# EAGLE design persimmon_circle (EAGLE 9.6.2)
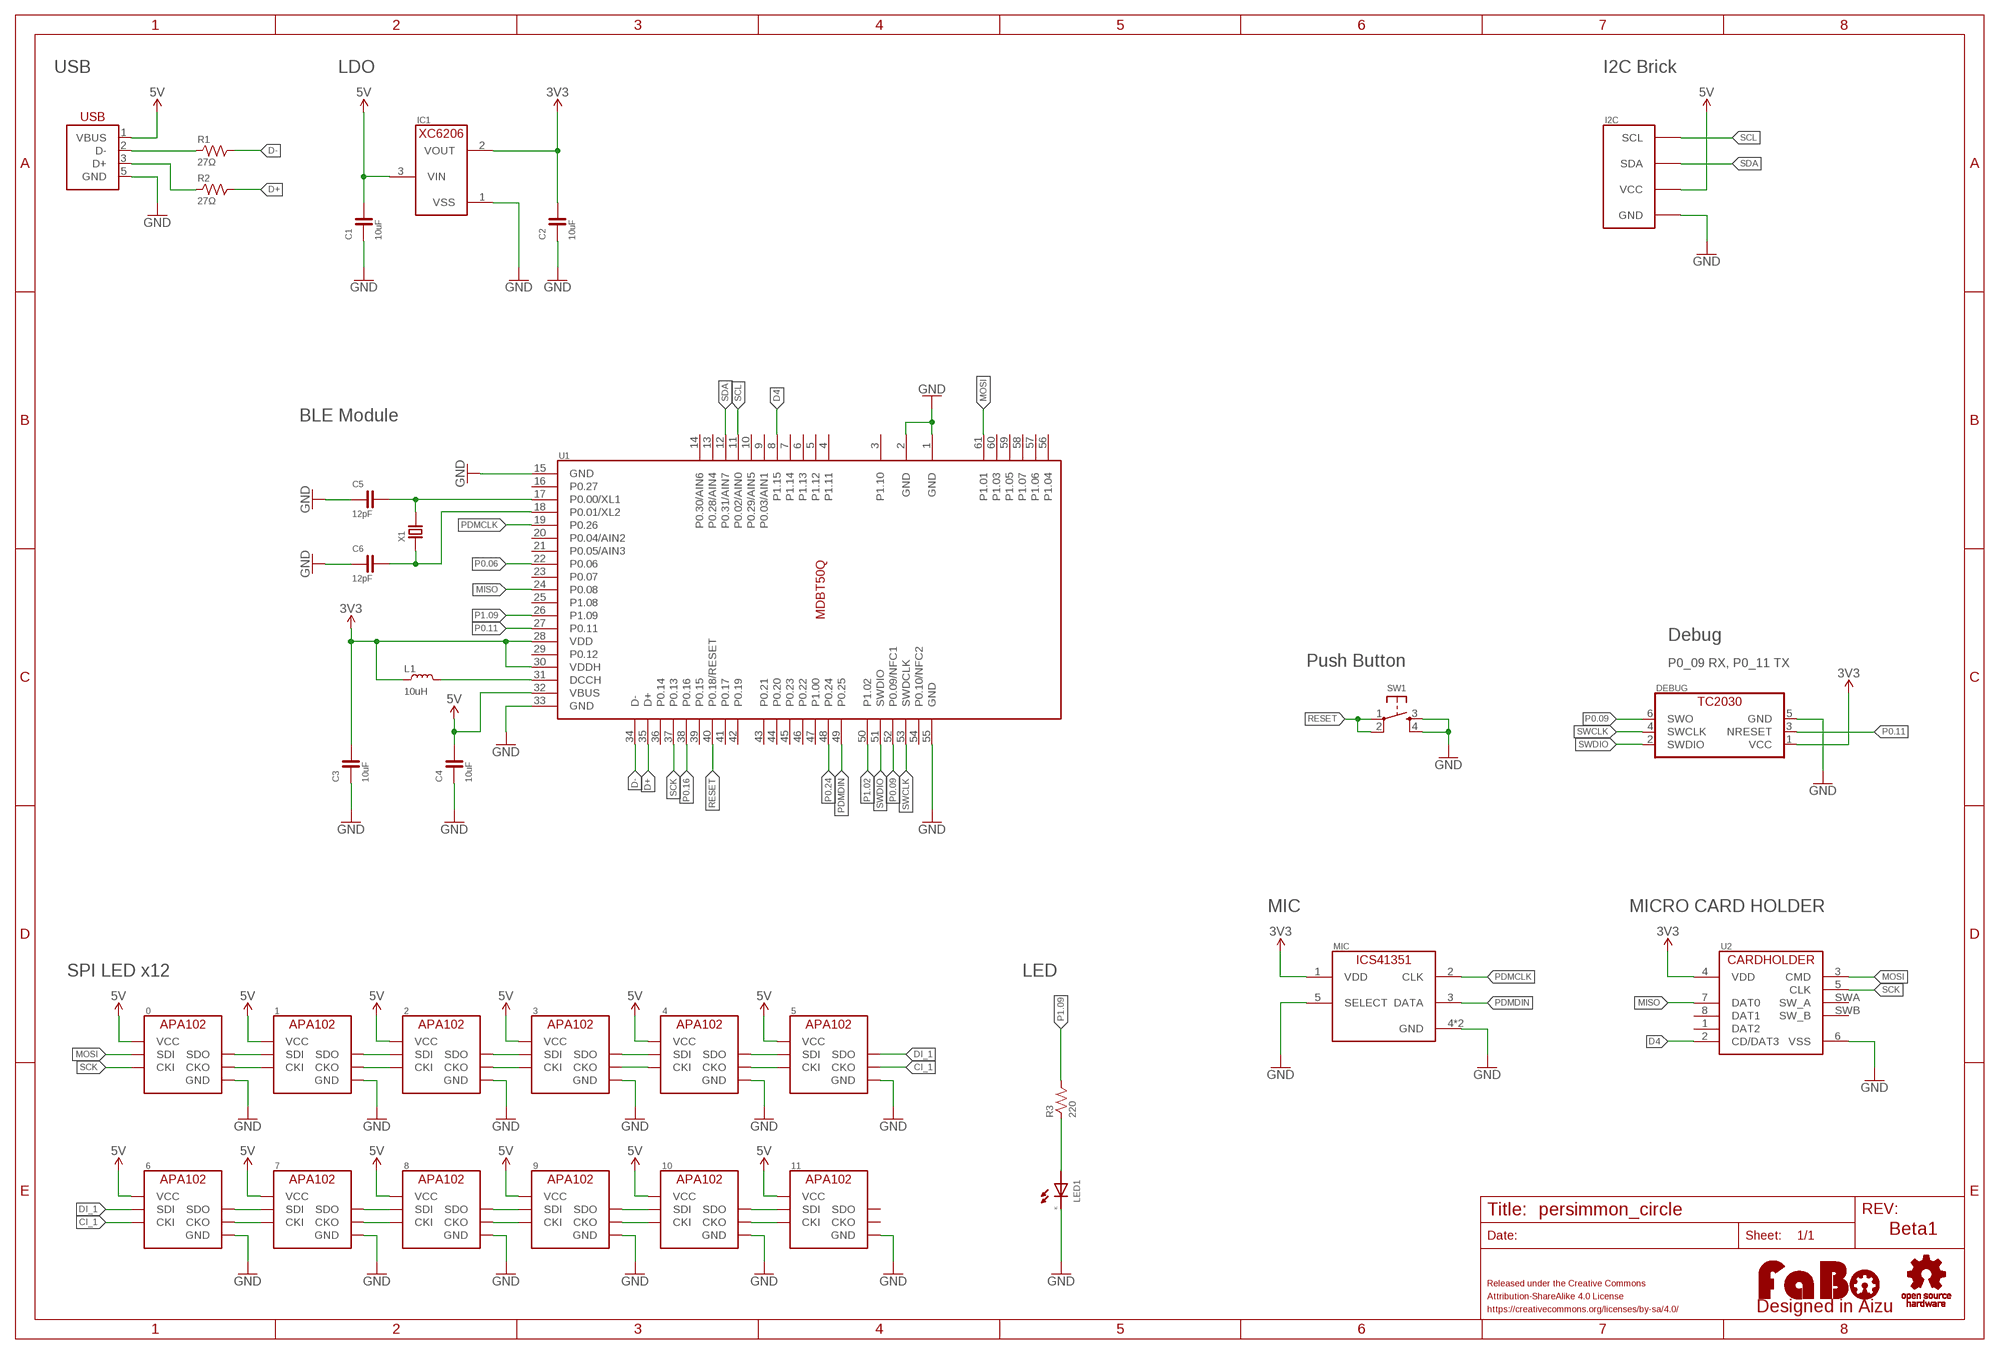
[diagram p0: schematic, sheet 1]

## Parts
0  APA102_IPIXEL  [APA102_2020]
1  APA102_IPIXEL  [APA102_2020]
2  APA102_IPIXEL  [APA102_2020]
3  APA102_IPIXEL  [APA102_2020]
4  APA102_IPIXEL  [APA102_2020]
5  APA102_IPIXEL  [APA102_2020]
6  APA102_IPIXEL  [APA102_2020]
7  APA102_IPIXEL  [APA102_2020]
8  APA102_IPIXEL  [APA102_2020]
9  APA102_IPIXEL  [APA102_2020]
10  APA102_IPIXEL  [APA102_2020]
11  APA102_IPIXEL  [APA102_2020]
C1  10uF  CAPACITOR-0603  [0603]
C2  10uF  CAPACITOR-0603  [0603]
C3  10uF  CAPACITOR-0603  [0603]
C4  10uF  CAPACITOR-0603  [0603]
C5  12pF  CAPACITOR-0603  [0603]
C6  12pF  CAPACITOR-0603  [0603]
DEBUG  TC2030-IDC-NL  [TC2030-IDC-NL]
I2C  FABO_BRICK_I2C-B04B-PASK-1  [FABO_BRICK_I2C_B04B-PASK-1]
IC1  XC6206  [SOT-23]
L1  10uH  COIL-0603  [0603]
LED1  LED-0603  [0603]
LOGO1  LOGO_OSHW-M_BOTTOM  [LOGO_OSHW_M_BOTTOM]
LOGO2  LOGO_FABO-M  [LOGO_FABO_M]
MIC  TDK-ICS41351  [ICS41351]
R1  27Ω  RESISTOR-0603  [0603]
R2  27Ω  RESISTOR-0603  [0603]
R3  220  RESISTOR-0603  [0603]
SW1  TACT-SWITCH-SMD_KMR2  [KMR2]
U1  MDBT50  [MDBT50]
U2  CARDHOLDER_MICRO  [DM3AT-SF-PEJM5]
USB  USB-ZX62D-B-5PA8  [ZX62D-B-5PA8]
X1  CRYSTAL-ABS07  [ABRACON-ABS07-32.768KHZ]

## Nets
3V3: C2.2 C3.2 DEBUG.1(VCC) IC1.2(VOUT) L1.1 MIC.1(VDD) U1.28(VDD) U1.30(VDDH) U2.4(VDD)
5V: 0.VCC 1.VCC 2.VCC 3.VCC 4.VCC 5.VCC 6.VCC 7.VCC 8.VCC 9.VCC 10.VCC 11.VCC C1.2 C4.2 I2C.VCC IC1.3(VIN) U1.32(VBUS) USB.1(VBUS)
CI0: 0.CKO 1.CKI
CI1: 1.CKO 2.CKI
CI2: 2.CKO 3.CKI
CI3: 3.CKO 4.CKI
CI4: 4.CKO 5.CKI
CI6: 6.CKO 7.CKI
CI7: 7.CKO 8.CKI
CI8: 8.CKO 9.CKI
CI9: 9.CKO 10.CKI
CI10: 10.CKO 11.CKI
CI_1: 5.CKO 6.CKI
D4: U1.8(P1.15) U2.2(CD/DAT3)
D+: R2.2 U1.35(D+)
D-: R1.2 U1.34(D-)
DI0: 0.SDO 1.SDI
DI1: 1.SDO 2.SDI
DI2: 2.SDO 3.SDI
DI3: 3.SDO 4.SDI
DI4: 4.SDO 5.SDI
DI6: 6.SDO 7.SDI
DI7: 7.SDO 8.SDI
DI8: 8.SDO 9.SDI
DI9: 9.SDO 10.SDI
DI10: 10.SDO 11.SDI
DI_1: 5.SDO 6.SDI
GND: 0.GND 1.GND 2.GND 3.GND 4.GND 5.GND 6.GND 7.GND 8.GND 9.GND 10.GND 11.GND C1.1 C2.1 C3.1 C4.1 C5.1 C6.1 DEBUG.5(GND) I2C.GND IC1.1(VSS) LED1.CATHODE MIC.4(GND) MIC.5(SELECT) MIC.6(GND) SW1.3 SW1.4 U1.1(GND) U1.2(GND) U1.15(GND) U1.33(GND) U1.55(GND) U2.6(VSS) USB.5(GND)
L1: L1.2 U1.31(DCCH)
LED1: LED1.ANODE R3.1
MISO: U1.24(P0.08) U2.7(DAT0)
MOSI: 0.SDI U1.61(P1.01) U2.3(CMD)
P0.06: U1.22(P0.06)
P0.09: DEBUG.6(SWO) U1.52(P0.09/NFC1)
P0.11: DEBUG.3(NRESET) U1.27(P0.11)
P0.16: U1.38(P0.16)
P0.24: U1.48(P0.24)
P1.02: U1.50(P1.02)
P1.09: R3.2 U1.26(P1.09)
PDMCLK: MIC.2(CLK) U1.19(P0.26)
PDMDIN: MIC.3(DATA) U1.49(P0.25)
RESET: SW1.1 SW1.2 U1.40(P0.18/RESET)
SCK: 0.CKI U1.37(P0.13) U2.5(CLK)
SCL: I2C.SCL U1.11(P0.02/AIN0)
SDA: I2C.SDA U1.12(P0.31/AIN7)
SWCLK: DEBUG.4(SWCLK) U1.53(SWDCLK)
SWDIO: DEBUG.2(SWDIO) U1.51(SWDIO)
USB_DM: R1.1 USB.2(D-)
USB_DP: R2.1 USB.3(D+)
X1: C5.2 U1.17(P0.00/XL1) X1.P$2
X2: C6.2 U1.18(P0.01/XL2) X1.P$1
Unconnected: 11.CKO 11.SDO U1.3(P1.10) U1.4(P1.11) U1.5(P1.12) U1.6(P1.13) U1.7(P1.14) U1.9(P0.03/AIN1) U1.10(P0.29/AIN5) U1.13(P0.28/AIN4) U1.14(P0.30/AIN6) U1.16(P0.27) U1.20(P0.04/AIN2) U1.21(P0.05/AIN3) U1.23(P0.07) U1.25(P1.08) U1.29(P0.12) U1.36(P0.14) U1.39(P0.15) U1.41(P0.17) U1.42(P0.19) U1.43(P0.21) U1.44(P0.20) U1.45(P0.23) U1.46(P0.22) U1.47(P1.00) U1.54(P0.10/NFC2) U1.56(P1.04) U1.57(P1.06) U1.58(P1.07) U1.59(P1.05) U1.60(P1.03) U2.1(DAT2) U2.8(DAT1) U2.SWA(SW_A) U2.SWB(SW_B)

## Notes on the sheet
- USB | LDO | I2C Brick
- BLE Module
- Debug
- Push Button | P0_09 RX, P0_11 TX
- MIC | MICRO CARD HOLDER
- SPI LED x12 | LED
- Beta1

## Library data of the parts
0 1-11 = FaBo-LED:APA102
C1-C6 = FaBo-Capacitor:CAPACITOR: CAPACITOR
DEBUG = FaBo-Debbuger:TC2030-IDC
I2C = FaBo-Template:FABO_BRICK_I2C: FaBo Brick I2C
IC1 = FaBo-VoltageRegulator:XC6206
L1 = FaBo-Coil:COIL: RESISTOR
LED1 = FaBo-LED:LED
LOGO1 = FaBo-Logo:LOGO_OSHW
LOGO2 = FaBo-Logo:LOGO_FABO
MIC = FaBo-Sound:TDK-ICS41351
R1-R3 = FaBo-Resistors:RESISTOR: RESISTOR
SW1 = FaBo-Switch:TACT-SWITCH: Part No Maker Datasheet Distributor 1273HA-160G-G SWITRONIC Catalog <http://www.switronic.com/uploads/images/A10.gif> Akizuki <http://akizukidenshi.com/catalog/g/gP-02561/> DTS-6-V Cosland DTS 6 Series <http://www.cosland.com/newproduct/DTS%20SERIES.pdf> Akizuki <http://akizukidenshi.com/catalog/g/gP-03647/> KMR2 C&K KMR2 SERIES <https://www.ckswitches.com/products/switches/product-details/Tactile/KMR2/> Octoparts Result <https://octopart.com/search?q=KMR2&start=0> TSHA-T-XB2-19E TOP UP INDUSTORY TSHA-T <http://www.top-up.com.tw/front/bin/ptdetail.phtml?Part=TSHA-T> Akizuki <http://akizukidenshi.com/catalog/g/gP-09361/>
U1 = MDBT50Q_171031:MDBT50: Raytac Corporation MDBT50 Bluetooth Low Energy Module based on Noridc nRF52840 Source: Raytac datasheet
U2 = FaBo-SD:CARDHOLDER_MICRO
USB = FaBo-USB:USB: Parts No Maker Datasheet Distributor B05B-PASK-1 JST Datasheet <http://www.jst-mfg.com/product/pdf/eng/ePA-F.pdf> Octoparts Result <https://octopart.com/search?q=B05B-PASK-1> DX4R005JJ2R1800 JAE Datasheet <https://www.jae.com/z-jp/product_jp.cfm?l_code=JA&series_code=DX4&product_number=DX4R005JJ2R1800> Octoparts Result <https://octopart.com/dx4r005jj2r1800-jae+electronics-22232443> S04B-PASK-2 JST Web <http://www.jst-mfg.com/product/detail.php?series=189> Octoparts Result <https://octopart.com/search?q=S04B-PASK-2&start=0> USB-4AF103BS Useconn Electronics Datasheet <http://akizukidenshi.com/download/ds/useconn/USB-4AF103BS-Rev_C.PDF> Akizuki <http://akizukidenshi.com/catalog/g/gC-11551/> USB-A-4P-MALE(1734028-1) TE Web <http://www.te.com/jpn-ja/product-1734028-1.html> Octopart Result <https://octopart.com/1734028-1-te+connectivity-40535237> USB2-AF-WTP-CS-QRFL VPI Datasheet <https://www.vpi.us/dpdf/70/usb2-af-wtp-cs-qrfl.pdf> VPI Store <https://www.vpi.us/usba-waterproof/waterproof-usb-typeb-qrfl-357> ZX62R-B-5P VPI Web <https://www.hirose.com/product/jp/products/ZX/ZX62R-B-5P(30)/> Octopart Result <https://octopart.com/zx62d-b-5p8%2830%29-hirose-70111550>
X1 = FaBo-Crystal:CRYSTAL

## Net classes
2 gnd: width 0.254 mm, drill 0.61 mm, clearance 0.254 mm
3 usbvcc: width 0.254 mm, drill 0.61 mm, clearance 0.254 mm
4 aref: width 0.254 mm, drill 0.61 mm, clearance 0.254 mm

## Board
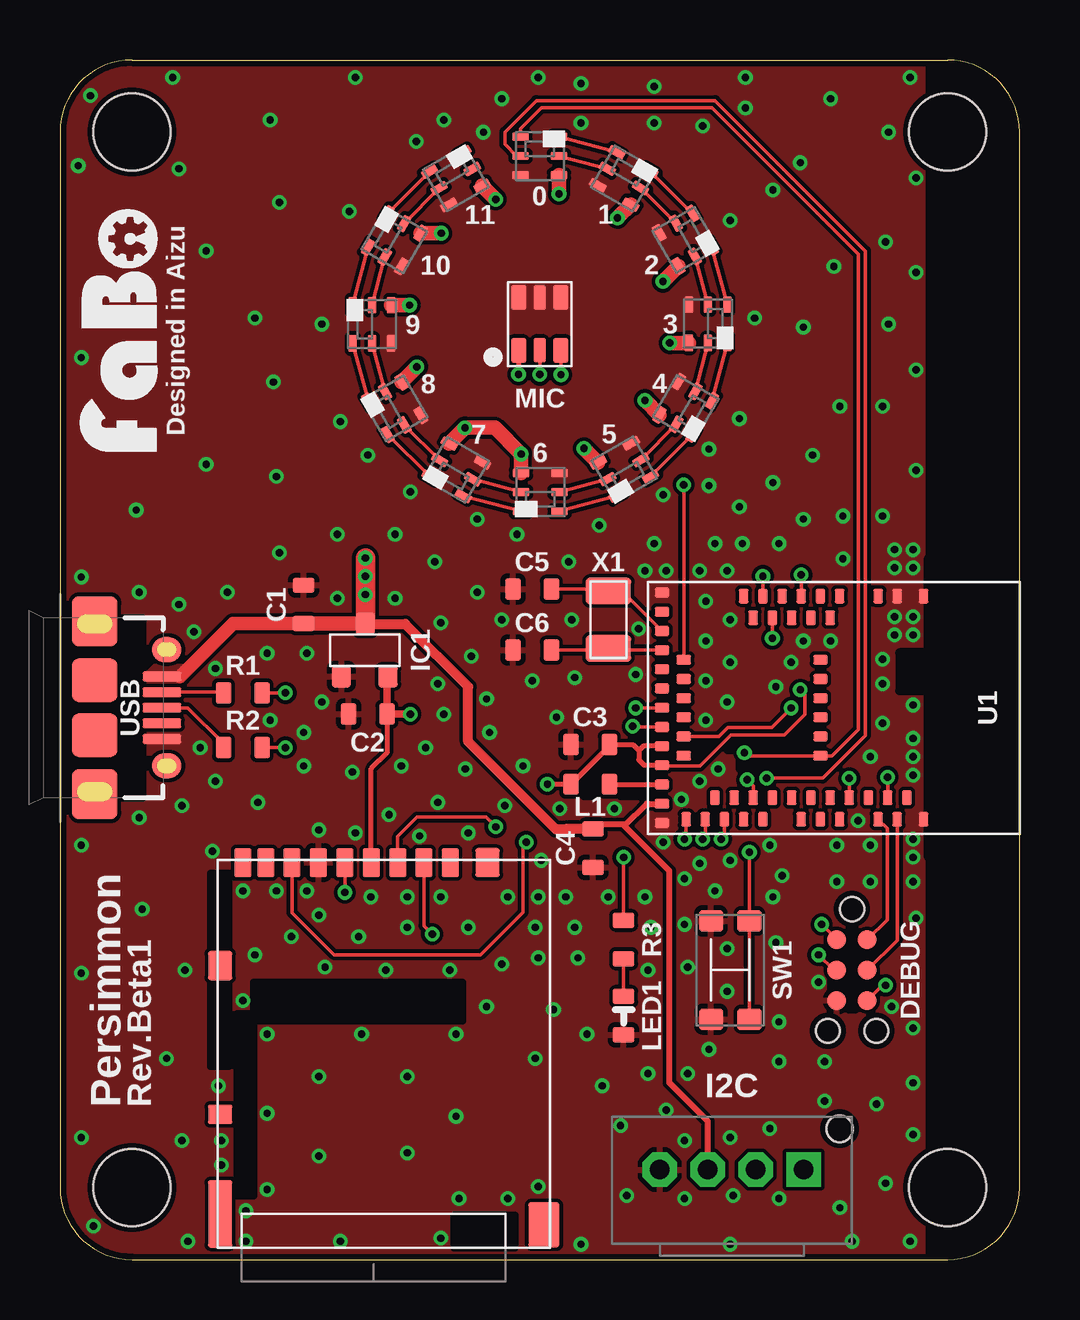
[diagram p1: board, top side]
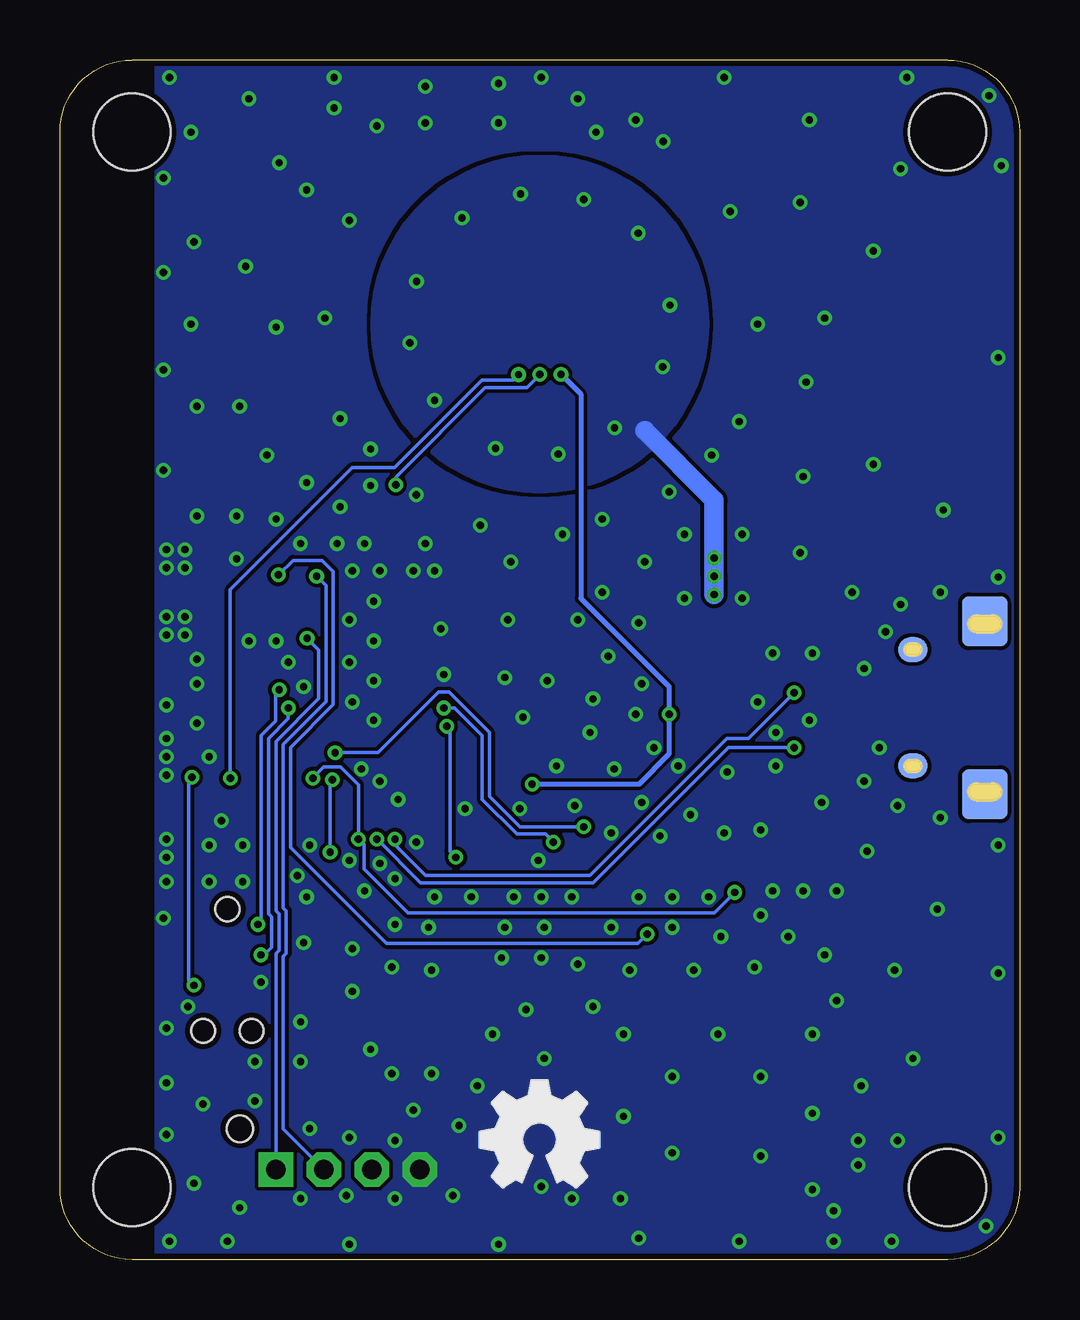
[diagram p2: board, bottom side, seen from below]

Size 40 x 50 mm. Coordinates in mm from the lower left corner, seen from the top.
Outline: 40,3 40,47 arc90 37,50 3,50 arc90 0,47 0,3 arc90 3,0 37,0 arc90 40,3
Copper layers (1*16): Top 0.035mm / dielectric 1.6mm / Bottom 0.035mm
Design rules "PCBway": minimum track width 6mil, minimum drill 12mil, track to track 6mil, track to pad 6mil, pad to pad 6mil, via to via 6mil, smd to smd 6mil, copper to edge 10mil, drill to drill 10mil, minimum pad ring 10mil, minimum via ring 6mil, stop-mask expansion 2mil, vias tented up to drill 100mil, thermal gap 8mil
Holes 3.2 mm at 3,3 37,3 3,47 37,47
tRestrict: area 21.8,19.3 to 22.4,19.4; area 23.4,19.3 to 24.3,19.4; area 28.3,20.4 to 28.4,20.7; area 27.8,21.2 to 28.1,21.3

### Footprints (pad centres in the part's own frame; a part is rotated, then mirrored left to right if it is on the bottom)
APA102_2020 = smd 0.7 x 0.35: CKI 0.8,0; CKO -0.8,0; GND 0.8,0.8; SDI 0.8,-0.8; SDO -0.8,-0.8; VCC -0.8,0.8
0603 = smd 0.65 x 0.9: 1 -0.8,0; 2 0.8,0
TC2030-IDC-NL = smd 0.787 x 0.787: 1 -1.27,-0.635; 2 -1.27,0.635; 3 0,-0.635; 4 0,0.635; 5 1.27,-0.635; 6 1.27,0.635 | hole 0.991: -2.54,0; 2.54,1.016; 2.54,-1.016
FABO_BRICK_I2C_B04B-PASK-1 = drill 0.8 pad 1.422 octagon: GND -3,0; SDA 1,0; VCC -1,0 | drill 0.8 pad 1.422 square: SCL 3,0 | hole 1.1: 4.5,1.7
SOT-23 = smd 0.8 x 0.9: 1 -0.97,-1.1; 2 0.97,-1.1; 3 0.03,1.1
0603' = smd 0.65 x 0.9: ANODE -0.8,0; CATHODE 0.8,0
ICS41351 = smd 0.622 x 1.03: 1 0.884,1.1; 3 -0.884,1.1; 4 -0.884,-1.1; 6 0.884,-1.1 | smd 0.5 x 1.03: 2 0,1.1; 5 0,-1.1
KMR2 = smd 0.9 x 1: 1 -2.05,0.8; 2 2.05,0.8; 3 2.05,-0.8; 4 -2.05,-0.8
MDBT50 = smd 0.6 x 0.4: 1 -4.65,3.75; 2 -4.65,2.65; 3 -4.65,1.85; 4 -4.65,0.25; 5 -3.75,-0.15; 6 -4.65,-0.55; 7 -3.75,-0.95; 8 -4.65,-1.35; 9 -3.75,-1.75; 10 -4.65,-2.15; 11 -3.75,-2.55; 12 -4.65,-2.95; 13 -3.75,-3.35; 14 -4.65,-3.75; 34 4.65,-6.15; 35 4.65,-5.35; 36 3.75,-4.95; 37 4.65,-4.55; 38 3.75,-4.15; 39 4.65,-3.75; 40 3.75,-3.35; 41 4.65,-2.95; 42 3.75,-2.55; 43 3.75,-1.75; 44 4.65,-1.35; 45 3.75,-0.95; 46 4.65,-0.55; 47 3.75,-0.15; 48 4.65,0.25; 49 3.75,0.65; 50 3.75,1.45; 51 4.65,1.85; 52 3.75,2.25; 53 4.65,2.65; 54 3.75,3.05; 55 4.65,3.75 | smd 0.4 x 0.6: 15 -4.8,-7.15; 16 -4,-7.15; 17 -3.2,-7.15; 18 -2.4,-7.15; 19 -2,-6.25; 20 -1.6,-7.15; 21 -1.2,-6.25; 22 -0.8,-7.15; 23 -0.4,-6.25; 24 0,-7.15; 25 0.4,-6.25; 26 0.8,-7.15; 27 1.2,-6.25; 28 1.6,-7.15; 29 2,-6.25; 30 2.4,-7.15; 31 3.2,-7.15; 32 4,-7.15; 33 4.8,-7.15; 56 -2,-0.55; 57 -1.2,-0.55; 58 -0.4,-0.55; 59 0.4,-0.55; 60 1.2,-0.55; 61 2,-0.55
DM3AT-SF-PEJM5 = smd 0.7 x 1.2: 1 2.775,16.05; 2 1.675,16.05; 3 0.575,16.05; 4 -0.525,16.05; 5 -1.625,16.05; 6 -2.725,16.05; 7 -3.825,16.05; 8 -4.925,16.05; SWB -5.875,16.05 | smd 1 x 1.2: SHD1 4.325,16.05; SHD2 -6.825,11.75 | smd 1 x 2.8: SHD3 -6.825,1.4 | smd 1.3 x 1.9: SHD4 6.675,0.95 | smd 1 x 0.8: SWA -6.825,5.55
ZX62D-B-5PA8 = smd 0.4 x 1.6: 1 -1.3,4.25; 2 -0.65,4.25; 3 0,4.25; 4 0.65,4.25; 5 1.3,4.25 | smd 1.05 x 1.25 bottom: B1 -2.425,4.45; B2 2.425,4.45 | smd 2.1 x 1.9 bottom: B3 -3.6,1.45; B4 3.6,1.45 | smd 1.05 x 1.25: T1 -2.425,4.45; T2 2.425,4.45 | smd 2.1 x 1.9: T3 -3.6,1.45; T6 3.6,1.45 | smd 1.8 x 1.9: T4 -1.15,1.45; T5 1.15,1.45
ABRACON-ABS07-32.768KHZ = smd 1.1 x 1.9: P$1 -1.2,0; P$2 1.2,0

### Placement (x,y rotation side)
0  20,46 180 top
1  23.5,45.07 150 top
2  26.07,42.51 120 top
3  27.02,39.01 90 top
4  26.08,35.5 60 top
5  23.52,32.93 30 top
6  20.02,31.99 0 top
7  16.52,32.92 330 top
8  13.95,35.48 300 top
9  13.01,38.98 270 top
10  13.94,42.49 240 top
11  16.5,45.06 210 top
C1  10.16,27.3 270 top
C2  12.83,22.73 0 top
C3  22.1,21.46 0 top
C4  22.23,17.14 90 top
C5  19.68,27.94 0 top
C6  19.68,25.4 0 top
DEBUG  33.02,12.06 270 top
I2C  28,3.75 0 top
IC1  12.7,25.4 0 top
L1  22.1,19.81 0 top
LED1  [0603']  23.5,10.16 270 top
LOGO1  20,5 0 top
LOGO2  4.45,38.73 90 top
MIC  20,39 180 top
R1  7.62,23.62 0 top
R2  7.62,21.34 0 top
R3  23.5,13.34 90 top
SW1  27.94,12.06 270 top
U1  32.25,23 270 top
U2  13.5,0.5 0 top
USB  0,23 270 top
X1  22.86,26.67 90 top

### Tracks (layer width: path | path; a pad name or v marks a point on that pad's centre or on a via)
3V3  (via drill 0.3)
  Top 0.152: v30.86,23.75 31.04,23.57 31.04,22.72 30.19,21.87 27.96,21.87 26.67,20.57 25.13,20.57 U1.30 | DEBUG.1 v31.75,13.97
  Top 0.203: MIC.1 v19.12,36.9 | C2.2 13.63,21.12 12.97,20.47 U2.4 | U1.28 24.32,21.4 24.13,21.21 | U1.30 24.36,20.6 24.13,20.83 24.13,21.21 | 24.13,21.21 23.88,21.46 C3.2 22.9,21.41 L1.1 v20.32,19.81
  Top 0.254: 13.63,24.26 IC1.2
  Top 0.305: 13.63,24.26 C2.2 v14.61,22.73
  Bottom 0.152: v30.86,23.75 31.01,23.6 31.01,22.45 31.61,21.85 31.61,14.11 v31.75,13.97
  Bottom 0.203: v19.12,36.9 18.29,36.07 18.29,27.56 14.61,23.88 v14.61,22.73 14.61,21.08 15.88,19.81 v20.32,19.81
5V  (via drill 0.3)
  Top 0.254: U1.32 24.46,19 23.53,18.07 | C4.2 22.42,18.14 23.47,18.14 23.53,18.07 | I2C.VCC 27,5.77 25.4,7.37 25.4,16.2 23.53,18.07
  Top 0.406: USB.1 5.01,24.3 | IC1.3 14.39,26.5 17.02,23.88 17.02,21.59 20.66,17.95 21.08,17.95 C4.2
  Top 0.559: C1.2 7.21,26.5 5.01,24.3
  Top 0.61: 0.VCC v20.8,44.42 | 1.VCC v23.24,43.42 | C1.2 IC1.3 | 2.VCC v25.13,40.77 | 3.VCC v25.42,38.2 | 4.VCC v24.39,35.81 | 5.VCC v21.84,33.81 | 6.VCC v19.22,33.57 18.12,34.67 v16.88,34.67 7.VCC | 8.VCC v14.88,37.21 | 9.VCC v14.57,39.78 | 10.VCC v15.89,42.78 | 11.VCC v18.16,44.19
  Top 0.813: IC1.3 v12.73,28.48 v12.73,29.24
  Bottom 0.813: v12.73,27.72 v12.73,28.48 12.73,31.65 15.62,34.54
  pour Bottom (isolate 0.152, rank 2, no thermals): 20,46 arc-90 27,39 arc-90 20,32 arc-90 13,39 arc-90
  pour Top (isolate 0.152, rank 2, no thermals): 5.21,24.26 5.21,24.77 3.94,24.77 3.43,24.26 3.43,24 4.95,24
CI0
  Top 0.152: 0.CKO 1.CKI
CI1
  Top 0.152: 1.CKO 2.CKI
CI2
  Top 0.152: 2.CKO 3.CKI
CI3
  Top 0.152: 3.CKO 4.CKI
CI4
  Top 0.152: 4.CKO 5.CKI
CI6
  Top 0.152: 6.CKO 7.CKI
CI7
  Top 0.152: 7.CKO 8.CKI
CI8
  Top 0.152: 8.CKO 9.CKI
CI9
  Top 0.152: 9.CKO 10.CKI
CI10
  Top 0.152: 10.CKO 11.CKI
CI_1
  Top 0.152: 5.CKO 6.CKI
D4  (via drill 0.3)
  Top 0.152: U1.8 v30.9,28.54 | U2.2 15.18,13.91 v15.52,13.56
  Bottom 0.152: v30.9,28.54 30.29,29.14 29.08,29.14 28.61,28.67 28.61,23.13 30.39,21.35 30.39,17.18 26.39,13.18 15.9,13.18 v15.52,13.56
D+  (via drill 0.3)
  Top 0.152: R2.2 v9.4,21.34 | v26.8,17.53 26.9,17.63 U1.35
  Bottom 0.152: v26.8,17.53 v26.79,17.53 24.96,15.7 17.78,15.7 12.14,21.34 v9.4,21.34
D-  (via drill 0.3)
  Top 0.152: R1.2 v9.4,23.62 | v26.04,17.53 26.1,17.59 U1.34
  Bottom 0.152: v26.04,17.53 26.04,17.27 24.77,16 17.91,16 12.19,21.72 11.3,21.72 v9.4,23.62
DI0
  Top 0.152: 0.SDO 1.SDI
DI1
  Top 0.152: 1.SDO 2.SDI
DI2
  Top 0.152: 2.SDO 3.SDI
DI3
  Top 0.152: 3.SDO 4.SDI
DI4
  Top 0.152: 5.SDI 4.SDO
DI6
  Top 0.152: 7.SDI 6.SDO
DI7
  Top 0.152: 8.SDI 7.SDO
DI8
  Top 0.152: 9.SDI 8.SDO
DI9
  Top 0.152: 10.SDI 9.SDO
DI10
  Top 0.152: 11.SDI 10.SDO
DI_1
  Top 0.152: 6.SDI 5.SDO
GND  (via drill 0.3)
  other vias: 1.4,1.4 35.56,28.83 35.56,29.59 34.8,28.83 34.8,29.59 35.56,26.8 35.56,26.04 34.8,26.04 34.8,26.8 35.56,20.19 35.56,23.11 35.56,21.72 35.56,17.53 35.56,16.76 27.05,33.78 14.22,20.57 15.75,19.05 20.83,18.8 23.11,18.8 22.86,15.11 24.38,15.11 17.02,17.78 15.24,21.34 24.64,13.84 26.67,16.51 25.15,17.4 21.08,15.11 19.94,15.11 20.07,16.64 27.94,16.64 27.3,15.37 26.04,13.97 29.59,17.27 21.46,13.84 19.81,13.84 18.54,18.92 14.99,17.65 18.67,15.11 15.88,15.11 14.48,15.11 12.95,15.11 13.72,18.54 16.89,20.45 19.3,20.57 15.75,24 17.78,23.37 12.32,17.78 12.19,20.32 10.16,21.97 10.16,20.57 10.92,23.24 5.84,21.34 6.48,24.64 5.59,26.16 10.29,15.37 9.02,15.37 7.62,15.37 17.02,13.84 14.48,13.84 10.79,14.35 9.65,13.46 13.59,12.06 11.05,12.19 19.94,12.57 21.59,12.57 24.51,12.06 26.16,12.19 30.1,16 33.27,18.29 32.38,17.27 33.78,17.27 32.38,15.75 33.78,15.75 35.56,15.75 35.69,14.22 25.91,19.18 26.67,19.94 26.92,22.48 27.81,23.24 26.92,24.13 27.94,24.89 26.92,25.78 27.94,26.67 26.92,27.43 29.84,23.88 30.48,24.89 30.99,25.78 32.13,25.78 34.29,25.02 34.29,24 34.29,22.35 33.78,20.95 24,24.38 21.46,24.26 20.7,22.61 19.68,24.13 21.34,26.67 24.13,26.29 18.41,26.67 17.4,27.81 21.21,29.08 24.38,28.7 25.27,28.7 26.67,28.7 27.81,28.7 29.97,29.84 32.64,29.21 28.45,29.84 27.3,29.84 24.77,29.84 25.15,31.88 27.05,32.26 28.32,31.37 29.72,32.38 34.29,35.56 32.51,35.56 34.29,30.99 7.62,10.79 8.64,9.4 6.6,7.24 6.73,4.95 6.73,3.94 7.75,0.76 15.88,0.89 18.67,2.54 19.94,3.05 7.75,2.03 5.33,0.76 35.43,0.76 34.42,3.17 35.56,5.21 33.02,0.76 21.72,0.64 27.94,0.64 29.97,2.54 26.04,2.54 26.04,4.95 27.94,5.08 29.59,5.46 31.88,6.6 32.51,2.16 28.07,2.67 23.62,2.67 25.27,6.22 26.16,7.75 29.97,9.91 27.05,8.76 24.51,7.75 21.97,9.4 31.88,8.26 29.97,8.26 35.56,9.65 35.56,7.37 34.04,6.48 29.84,13.21 27.81,12.95 27.81,11.18 8.13,12.7 16.51,9.4 17.78,10.54 8.64,6.1 10.79,4.32 19.81,8.38 10.79,7.62 8.64,2.92 12.57,9.4 0.89,5.08 5.08,4.95 6.35,17.02 10.79,17.91 6.48,19.94 8.26,19.05 3.3,18.41 0.89,17.27 0.89,11.94 3.43,14.61 5.21,12.06 4.45,8.38 10.29,25.27 8.64,25.27 17.14,25.15 15.88,26.54 13.97,27.56 11.56,27.56 17.4,30.86 19.05,30.23 14.61,32 12.83,33.53 11.56,30.23 13.97,30.23 15.62,29.08 22.48,30.61 0.89,28.45 3.3,27.81 6.99,27.81 9.14,29.46 1.27,48.51 0.76,45.59 4.7,49.28 4.95,45.47 0.89,37.59 6.1,42.04 6.1,33.15 21.72,47.37 21.72,49.02 35.43,49.28 19.94,49.28 35.69,45.09 34.54,46.99 28.57,49.28 12.32,49.28 8.76,47.5 16,47.5 26.8,47.24 29.72,44.58 30.86,45.72 32.26,41.4 34.42,42.42 30.99,38.86 31.37,33.53 35.69,37.08 35.69,41.15 10.92,38.99 11.68,34.92 28.32,35.05 28.96,39.24 27.94,43.31 24.77,47.37 14.86,46.61 12.06,43.69 3.17,31.24 8.89,36.58 9.14,44.07 14.48,7.62 23.37,5.59 11.68,0.76 17.65,46.99 32.64,30.99 30.99,30.86 12.45,13.46 16.26,12.06 14.48,4.45 16.51,5.97 16.64,2.54 18.41,12.32 22.61,7.24 20.57,10.41 31.62,11.56 34.67,10.54 29.72,15.11 17.91,21.97 16,22.73 8.76,22.48 27.43,20.45 35.56,20.95 35.69,32.89 24.77,48.9 28.57,48.01 34.54,38.99 32.13,48.39 18.41,48.39 8.13,39.24 9.02,32.64 26.04,15.88 5.08,18.92 4.95,27.3
  pour Top (isolate 0.152, rank 3): 0,0 0,50 36,50 36,0
  pour Bottom (isolate 0.152, rank 3, no thermals): 0,0 0,50 36,50 36,0
  pour Top (isolate 0.152, rank 2, no thermals): 20,46 arc-90 27,39 arc-90 20,32 arc-90 13,39 arc-90
  pour Top (isolate 0.152, rank 3, no thermals): 36.2,28.45 24.26,28.45 24.26,17.4 36.2,17.4
  pour Top (isolate 0.152, rank 2, no thermals): 3.17,22.23 5.33,22.23 5.33,21.08 3.17,21.08
L1
  Top 0.203: L1.2 25.09,19.81 U1.31
LED1
  Top 0.152: R3.1 LED1.ANODE
MISO  (via drill 0.3)
  Top 0.152: U1.24 25.09,22.99 v24,22.99 | v19.43,17.4 19.3,17.27 19.3,14.48 17.53,12.7 11.43,12.7 9.68,14.46 U2.7
  Bottom 0.152: v24,22.99 23.55,22.99 22.4,21.84 22.4,19.18 20.95,17.73 19.76,17.73 v19.43,17.4
MOSI  (via drill 0.3)
  Top 0.152: 0.SDI 19.2,47.14 20.07,48.01 27.18,48.01 33.27,41.91 33.27,22.1 32.18,21 U1.61 28.66,21 v28.53,21.13 | U2.3 14.07,17.63 14.88,18.44 17.75,18.44 v18.16,18.03
  Bottom 0.152: v28.53,21.13 26.74,21.13 24.22,23.65 23.78,23.65 22.1,21.96 22.1,19.31 20.82,18.03 v18.16,18.03
P0.09  (via drill 0.3)
  Top 0.152: U1.52 v34.5,20.11 | DEBUG.6 34.29,11.43 v34.42,11.43
  Bottom 0.152: v34.42,11.43 34.63,11.64 34.63,19.98 v34.5,20.11
P0.11  (via drill 0.3)
  Top 0.152: U1.27 27.46,21.8 27.84,22.17 29.67,22.17 v30.48,22.99 | DEBUG.3 32.26,12.06 v31.62,12.7
  Bottom 0.152: v30.48,22.99 30.48,22.55 31.3,21.73 31.3,14.41 31.18,14.29 31.18,13.02 31.5,12.7 v31.62,12.7
P1.09  (via drill 0.3)
  Top 0.152: U1.26 23.9,22.2 v23.88,22.23 | R3.2 v23.5,16.76
  Bottom 0.152: v23.5,16.76 23.75,17.02 23.75,22.1 v23.88,22.23
PDMCLK  (via drill 0.3)
  Top 0.152: MIC.2 v20,36.89 | U1.19 v26,32.29
  Bottom 0.152: v26,32.29 26,32.62 22.27,36.35 20.54,36.35 v20,36.89
PDMDIN  (via drill 0.3)
  Top 0.152: MIC.3 v20.88,36.89 | U1.49 v32.9,20.06
  Bottom 0.152: v32.9,20.06 32.9,27.93 27.82,33.01 26.05,33.01 22.4,36.66 21.11,36.66 v20.88,36.89
RESET  (via drill 0.3)
  Top 0.152: v28.74,16.98 SW1.1 SW1.2 | U1.40 28.9,19.74 v28.65,20
  Bottom 0.152: v28.74,16.98 28.74,19.9 v28.65,20
SCK  (via drill 0.3)
  Top 0.152: 0.CKI 19.02,46 18.54,46.48 18.54,46.99 19.86,48.31 27.3,48.31 33.58,42.04 33.58,21.84 31.8,20.07 v29.46,20.07 | v27.56,17.53 27.7,17.67 U1.37 | U2.5 v11.88,15.3
  Bottom 0.152: v29.46,20.07 29,20.53 28.3,20.53 27.56,19.79 v27.56,17.53 27.33,17.3 27.33,16.29 25.49,14.45 12.72,14.45 v11.88,15.3
SCL  (via drill 0.3)
  Top 0.152: U1.11 v29.7,25.89
  Bottom 0.152: v29.7,25.89 29.22,25.41 29.22,23.38 31,21.6 31,14.54 30.87,14.41 30.87,12.89 31,12.77 I2C.SCL
SDA  (via drill 0.3)
  Top 0.152: U1.12 v29.3,28.48
  Bottom 0.152: v29.3,28.48 28.91,28.1 28.91,23.26 30.7,21.47 30.7,14.67 30.57,14.54 30.57,12.77 30.7,12.64 30.7,5.45 I2C.SDA
SWCLK
  Top 0.152: DEBUG.4 34.9,13.31 U1.53
SWDIO
  Top 0.152: U1.51 34.48,17.97 34.48,14.16 DEBUG.2
USB_DM
  Top 0.152: USB.2 6.79,23.65 R1.1
USB_DP
  Top 0.152: R2.1 6.82,21.5 5.32,23 USB.3
X1
  Top 0.152: U1.17 23.43,27.87 X1.P$2 22.79,27.94 C5.2
X2
  Top 0.152: U1.18 22.93,25.4 X1.P$1 22.79,25.4 C6.2

### Text on the board
tPlace: Designed in Aizu | Persimmon | Rev.Beta1